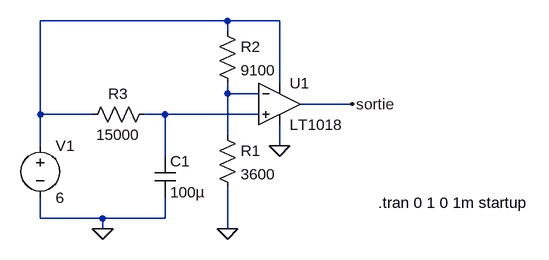
[diagram p0: schematic Test circuit.asc]
Test circuit.asc, the LTspice schematic file:
Version 4
SHEET 1 880 680
WIRE 352 -64 64 -64
WIRE 432 -64 352 -64
WIRE 352 -48 352 -64
WIRE 432 32 432 -64
WIRE 352 48 352 32
WIRE 400 48 352 48
WIRE 544 64 464 64
WIRE 64 80 64 -64
WIRE 144 80 64 80
WIRE 256 80 224 80
WIRE 400 80 256 80
WIRE 352 112 352 48
WIRE 64 128 64 80
WIRE 432 128 432 96
WIRE 256 144 256 80
WIRE 64 240 64 208
WIRE 160 240 64 240
WIRE 256 240 256 208
WIRE 256 240 160 240
WIRE 160 256 160 240
WIRE 352 256 352 192
FLAG 160 256 0
FLAG 432 128 0
FLAG 544 64 sortie
FLAG 352 256 0
SYMBOL voltage 64 112 R0
WINDOW 123 0 0 Left 0
WINDOW 39 0 0 Left 0
SYMATTR InstName V1
SYMATTR Value 6
SYMBOL res 240 64 R90
WINDOW 0 0 56 VBottom 2
WINDOW 3 32 56 VTop 2
SYMATTR InstName R3
SYMATTR Value 15000
SYMBOL cap 240 144 R0
SYMATTR InstName C1
SYMATTR Value 100µ
SYMBOL Comparators\\LT1018 432 64 R0
SYMATTR InstName U1
SYMBOL res 336 -64 R0
SYMATTR InstName R2
SYMATTR Value 9100
SYMBOL res 336 96 R0
SYMATTR InstName R1
SYMATTR Value 3600
TEXT 584 216 Left 2 !.tran 0 1 0 1m startup

The netlist it stands for:
* Test circuit.asc
V1 N001 0 6
R3 N003 N001 15000
C1 N003 0 100µ
XU1 N003 N002 N001 0 sortie LT1018  ; pins In+ In- V+ V- OUT
R2 N001 N002 9100
R1 N002 0 3600
.tran 0 1 0 1m startup
.lib LTC1.lib
.backanno
.end